# EAGLE design BlueESC (EAGLE 7.1.0)
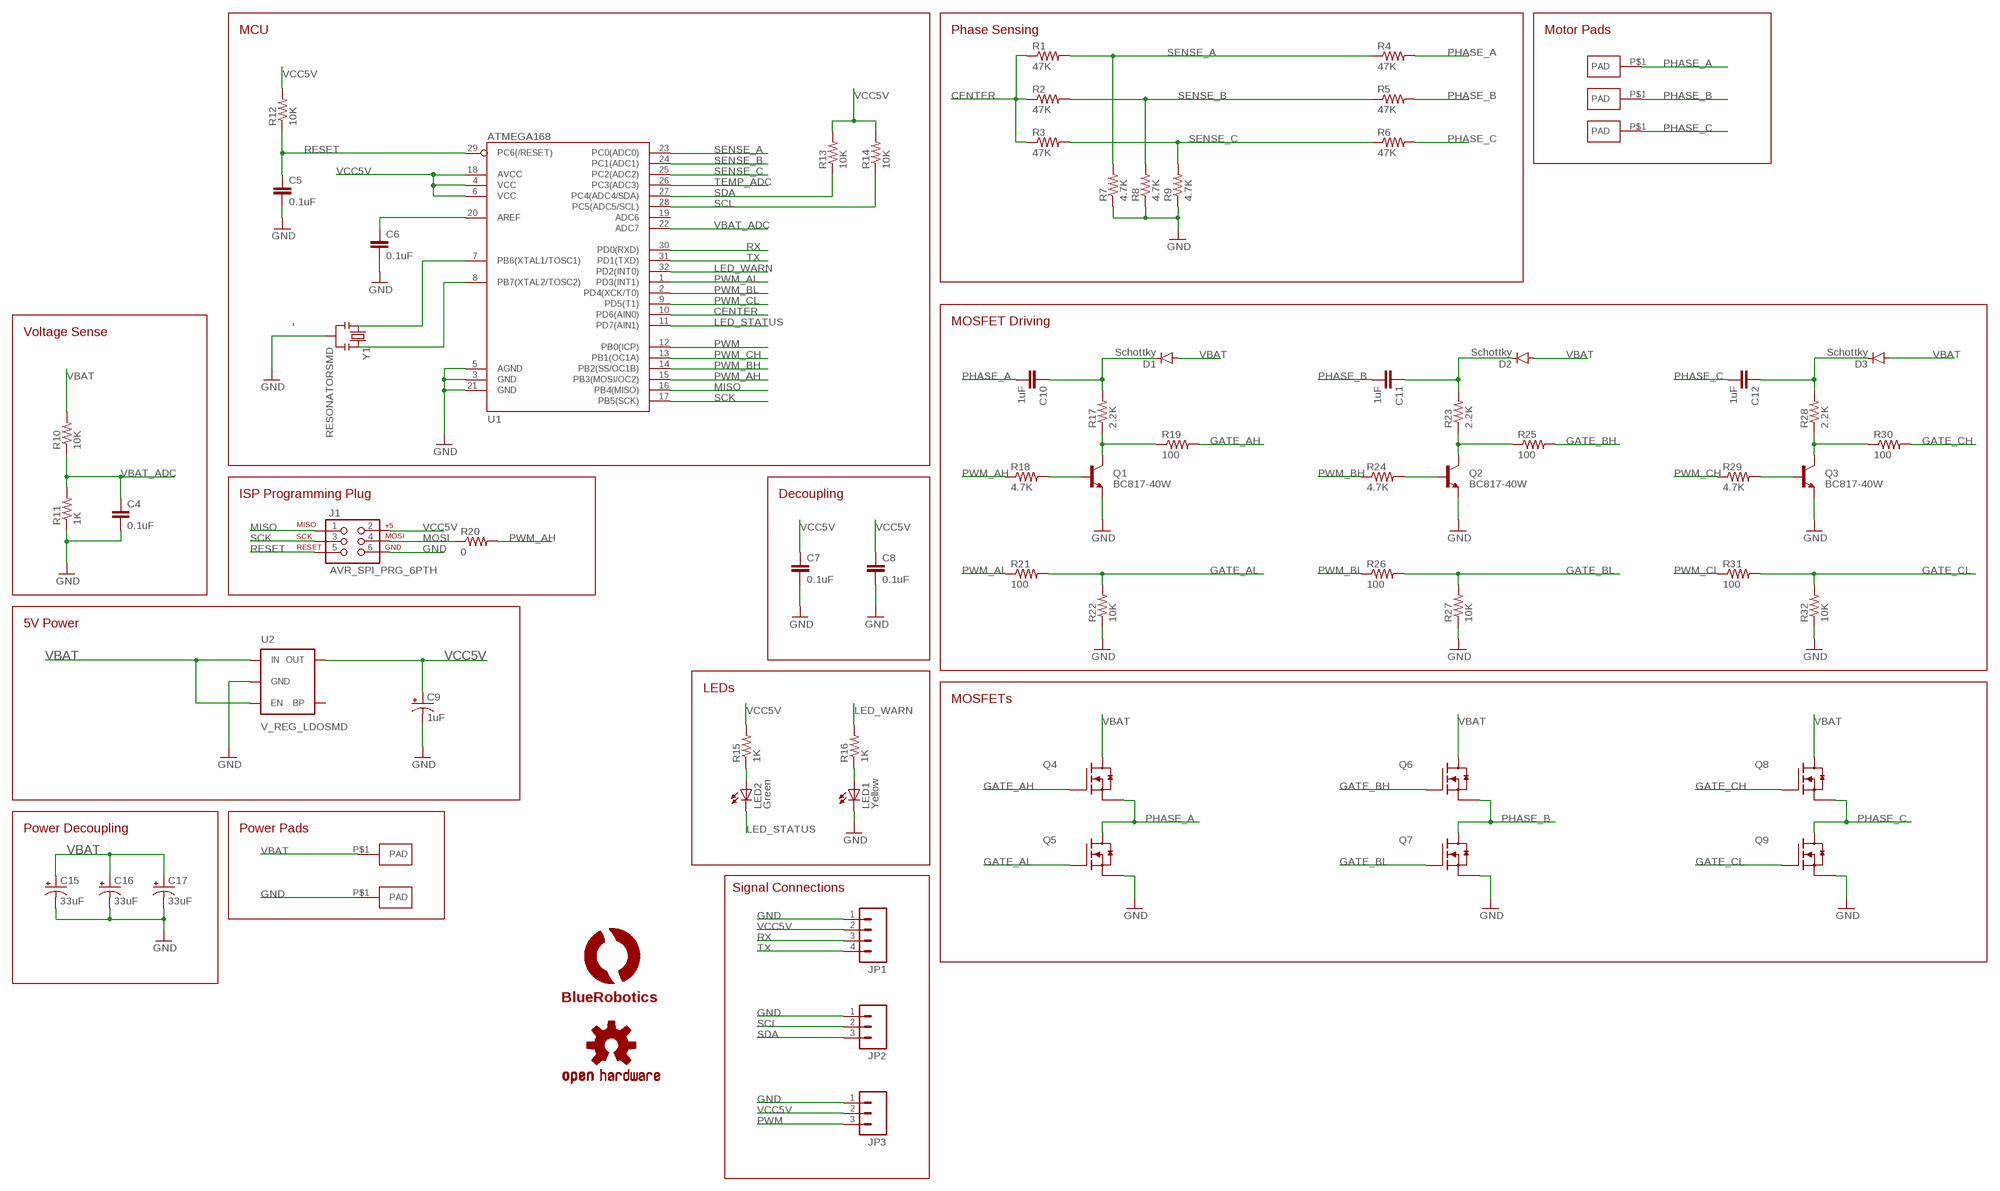
[diagram p0: schematic, sheet 1]

## Parts
C4  0.1uF  CAP0603-CAP  [0603-CAP]
C5  0.1uF  CAP0603-CAP  [0603-CAP]
C6  0.1uF  CAP0603-CAP  [0603-CAP]
C7  0.1uF  CAP0603-CAP  [0603-CAP]
C8  0.1uF  CAP0603-CAP  [0603-CAP]
C9  1uF  CAP_POL1206  [EIA3216]
C10  1uF  CAP0805  [0805]
C11  1uF  CAP0805  [0805]
C12  1uF  CAP0805  [0805]
C15  33uF  CAP_POL6032  [EIA6032]
C16  33uF  CAP_POL6032  [EIA6032]
C17  33uF  CAP_POL6032  [EIA6032]
D1  Schottky  DIODESOD  [SOD-323]
D2  Schottky  DIODESOD  [SOD-323]
D3  Schottky  DIODESOD  [SOD-323]
J1  AVR_SPI_PRG_6PTH  [2X3]
JP1  M04PTH  [1X04]
JP2  M03PTH  [1X03]
JP3  M03PTH  [1X03]
LED1  Yellow  LED0603  [LED-0603]
LED2  Green  LED0603  [LED-0603]
LOGO1  OSHW-LOGOM  [OSHW-LOGO-M]
Q1  BC817-40W  TRANSISTOR_NPNSOT23  [SOT23]
Q2  BC817-40W  TRANSISTOR_NPNSOT23  [SOT23]
Q3  BC817-40W  TRANSISTOR_NPNSOT23  [SOT23]
Q4  SI7370  [POWERPAK-SO-08]
Q5  SI7370  [POWERPAK-SO-08]
Q6  SiR158DP  SI7370  [POWERPAK-SO-08]
Q7  SI7370  [POWERPAK-SO-08]
Q8  SI7370  [POWERPAK-SO-08]
Q9  SI7370  [POWERPAK-SO-08]
R1  47K  33KOHM1/10W1%(0603)  [0603-RES]
R2  47K  33KOHM1/10W1%(0603)  [0603-RES]
R3  47K  33KOHM1/10W1%(0603)  [0603-RES]
R4  47K  33KOHM1/10W1%(0603)  [0603-RES]
R5  47K  33KOHM1/10W1%(0603)  [0603-RES]
R6  47K  33KOHM1/10W1%(0603)  [0603-RES]
R7  4.7K  RESISTOR0603  [0603-RES]
R8  4.7K  RESISTOR0603  [0603-RES]
R9  4.7K  RESISTOR0603  [0603-RES]
R10  10K  33KOHM1/10W1%(0603)  [0603-RES]
R11  1K  33KOHM1/10W1%(0603)  [0603-RES]
R12  10K  33KOHM1/10W1%(0603)  [0603-RES]
R13  10K  33KOHM1/10W1%(0603)  [0603-RES]
R14  10K  33KOHM1/10W1%(0603)  [0603-RES]
R15  1K  RESISTOR0603-RES  [0603-RES]
R16  1K  RESISTOR0603-RES  [0603-RES]
R17  2.2K  33KOHM1/10W1%(0603)  [0603-RES]
R18  4.7K  33KOHM1/10W1%(0603)  [0603-RES]
R19  100  33KOHM1/10W1%(0603)  [0603-RES]
R20  0  33KOHM1/10W1%(0603)  [0603-RES]
R21  100  33KOHM1/10W1%(0603)  [0603-RES]
R22  10K  33KOHM1/10W1%(0603)  [0603-RES]
R23  2.2K  33KOHM1/10W1%(0603)  [0603-RES]
R24  4.7K  33KOHM1/10W1%(0603)  [0603-RES]
R25  100  33KOHM1/10W1%(0603)  [0603-RES]
R26  100  33KOHM1/10W1%(0603)  [0603-RES]
R27  10K  33KOHM1/10W1%(0603)  [0603-RES]
R28  2.2K  33KOHM1/10W1%(0603)  [0603-RES]
R29  4.7K  33KOHM1/10W1%(0603)  [0603-RES]
R30  100  33KOHM1/10W1%(0603)  [0603-RES]
R31  100  33KOHM1/10W1%(0603)  [0603-RES]
R32  10K  33KOHM1/10W1%(0603)  [0603-RES]
U1  ATMEGA168  [TQFP32-08]
U2  V_REG_LDOSMD  [SOT23-5]
U$1  PADLARGE-ONE-SIDE  [PAD-0.2X0.3-ONE-SIDE]
U$2  PADLARGE-ONE-SIDE  [PAD-0.2X0.3-ONE-SIDE]
U$3  PADLARGE-ONE-SIDE  [PAD-0.2X0.3-ONE-SIDE]
U$4  LOGOBR-LOGO-M  [BR-LOGO-MEDIUM]
U$13  PADLARGE-ONE-SIDE  [PAD-0.2X0.3-ONE-SIDE]
U$14  PADLARGE-ONE-SIDE  [PAD-0.2X0.3-ONE-SIDE]
Y1  RESONATORSMD  [RESONATOR-SMD]

## Nets
CENTER: R1.1 R2.1 R3.1 U1.10(PD6(AIN0))
GATE_AH: Q4.4(G) R19.2
GATE_AL: Q5.4(G) R21.2 R22.2
GATE_BH: Q6.4(G) R25.2
GATE_BL: Q7.4(G) R26.2 R27.2
GATE_CH: Q8.4(G) R30.2
GATE_CL: Q9.4(G) R31.2 R32.2
GND: C4.2 C5.2 C6.2 C7.2 C8.2 C9.C(-) C15.P$2(-) C16.P$2(-) C17.P$2(-) J1.6 JP1.1 JP2.1 JP3.1 LED1.C Q1.2(E) Q2.2(E) Q3.2(E) Q5.3(S3) Q7.3(S3) Q9.3(S3) R7.1 R8.1 R9.1 R11.1 R22.1 R27.1 R32.1 U1.3(GND) U1.5(AGND) U1.21(GND) U2.2(GND) U$3.P$1(PAD) Y1.2
LED_STATUS: LED2.C U1.11(PD7(AIN1))
LED_WARN: R16.2 U1.32(PD2(INT0))
MISO: J1.1 U1.16(PB4(MISO))
MOSI: J1.4 R20.1
N$1: C10.1 D1.C R17.2
N$2: Q1.1(B) R18.2
N$3: LED1.A R16.1
N$4: Q1.3(C) R17.1 R19.1
N$5: Q2.1(B) R24.2
N$6: Q2.3(C) R23.1 R25.1
N$7: Q3.1(B) R29.2
N$8: C6.1 U1.20(AREF)
N$9: Q3.3(C) R28.1 R30.1
N$10: U1.7(PB6(XTAL1/TOSC1)) Y1.1
N$11: U1.8(PB7(XTAL2/TOSC2)) Y1.3
N$13: C11.1 D2.C R23.2
N$15: C12.1 D3.C R28.2
N$16: LED2.A R15.1
PHASE_A: C10.2 Q4.3(S3) Q5.5-8(D) R4.2 U$13.P$1(PAD)
PHASE_B: C11.2 Q6.3(S3) Q7.5-8(D) R5.2 U$14.P$1(PAD)
PHASE_C: C12.2 Q8.3(S3) Q9.5-8(D) R6.2 U$1.P$1(PAD)
PWM: JP3.3 U1.12(PB0(ICP))
PWM_AH: R18.1 R20.2 U1.15(PB3(MOSI/OC2))
PWM_AL: R21.1 U1.1(PD3(INT1))
PWM_BH: R24.1 U1.14(PB2(SS/OC1B))
PWM_BL: R26.1 U1.2(PD4(XCK/T0))
PWM_CH: R29.1 U1.13(PB1(OC1A))
PWM_CL: R31.1 U1.9(PD5(T1))
RESET: C5.1 J1.5 R12.1 U1.29(PC6(/RESET))
RX: JP1.3 U1.30(PD0(RXD))
SCK: J1.3 U1.17(PB5(SCK))
SCL: JP2.2 R14.1 U1.28(PC5(ADC5/SCL))
SDA: JP2.3 R13.1 U1.27(PC4(ADC4/SDA))
SENSE_A: R1.2 R4.1 R7.2 U1.23(PC0(ADC0))
SENSE_B: R2.2 R5.1 R8.2 U1.24(PC1(ADC1))
SENSE_C: R3.2 R6.1 R9.2 U1.25(PC2(ADC2))
TEMP_ADC: U1.26(PC3(ADC3))
TX: JP1.4 U1.31(PD1(TXD))
VBAT: C15.P$1(+) C16.P$1(+) C17.P$1(+) D1.A D2.A D3.A Q4.5-8(D) Q6.5-8(D) Q8.5-8(D) R10.2 U2.1(IN) U2.3(EN) U$2.P$1(PAD)
VBAT_ADC: C4.1 R10.1 R11.2 U1.22(ADC7)
VCC5V: C7.1 C8.1 C9.A(+) J1.2 JP1.2 JP3.2 R12.2 R13.2 R14.2 R15.2 U1.4(VCC) U1.6(VCC) U1.18(AVCC) U2.5(OUT)
Unconnected: Q4.1(S1) Q4.2(S2) Q5.1(S1) Q5.2(S2) Q6.1(S1) Q6.2(S2) Q7.1(S1) Q7.2(S2) Q8.1(S1) Q8.2(S2) Q9.1(S1) Q9.2(S2) U1.19(ADC6) U2.4(BP)

## Notes on the sheet
- MCU | Phase Sensing | Motor Pads
- MOSFET Driving
- Voltage Sense
- ISP Programming Plug | Decoupling
- 5V Power
- LEDs
- MOSFETs
- Power Decoupling | Power Pads
- Signal Connections

## Library data of the parts
C4-C8 C10-C12 = SparkFun-Capacitors:CAP: Capacitor Standard 0603 ceramic capacitor, and 0.1" leaded capacitor.
C9 C15-C17 = SparkFun-Capacitors:CAP_POL: Capacitor Polarized These are standard SMD and PTH capacitors. Normally 10uF, 47uF, and 100uF in electrolytic and tantalum varieties. Always verify the external diameter of the through hole cap, it varies with capacity, voltage, and manufacturer. The EIA devices should be standard.
D1-D3 = SparkFun-DiscreteSemi:DIODE: Diode These are standard reverse protection diodes and small signal diodes. SMA package can handle up to about 1A. SOD-323 can handle about 200mA. What the SOD-323 package when ordering, there are some mfgs out there that are 5-pin packages.; PROD_ID: DIO-09646
J1 = SparkFun:AVR_SPI_PRG_6: AVR ISP 6 Pin This is the reduced ISP connector for AVR programming. Common on Arduino. This footprint will take up less PCB space and can be used with a 10-pin to 6-pin adapter such as SKU: BOB-08508
JP1 = SparkFun-Connectors:M04: Header 4 Standard 4-pin 0.1" header. Use with straight break away headers (SKU : PRT-00116), right angle break away headers (PRT-00553), swiss pins (PRT-00743), machine pins (PRT-00117), and female headers (PRT-00115). Molex polarized connector foot print use with SKU : PRT-08231 with associated crimp pins and housings. 1MM SMD Version SKU: PRT-10208
JP2 JP3 = SparkFun-Connectors:M03: Header 3 Standard 3-pin 0.1" header. Use with straight break away headers (SKU : PRT-00116), right angle break away headers (PRT-00553), swiss pins (PRT-00743), machine pins (PRT-00117), and female headers (PRT-00115). Molex polarized connector foot print use with SKU : PRT-08232 with associated crimp pins and housings.
LED1 LED2 = SparkFun:LED: LEDs Standard schematic elements and footprints for 5mm, 3mm, 1206, and 0603 sized LEDs. 5mm - Spark Fun Electronics SKU : COM-00529 (and others)
LOGO1 = SparkFun-Aesthetics:OSHW-LOGO: Open Source Hardware Logo This logo indicates the piece of hardware it is found on incorporates a OSHW license and/or adheres to the definition of open source hardware found here: http://freedomdefined.org/OSHW
Q1-Q3 = SparkFun-DiscreteSemi:TRANSISTOR_NPN: Generic NPN BJT MMBT2222A - TRANS-08049 (SOT-23, 1A 40V) MPSA42 - TRANS-09116 (SOT-23, 500mA 300V) MMBT5088LT1G - TRANS-11160 (SOT-23, 50 mA 30V) BC547 - COM-08928 <http://www.sparkfun.com/products/8928> (TO-92 45V 100mA) (1.Collector 2.Base 3.Emitter) 2N3904 - COM-00521 <http://www.sparkfun.com/products/521> (TO-92 40V 200mA) (1.Emitter 2.Base 3.Collector) P2N2222A - COM-12852 <http://www.sparkfun.com/products/12852> (TO-92 40V 600mA) (1.Collector 2.Base 3.Emitter)
Q4-Q9 = transistor-fet-bobstarr:SI7370: N-Channel MOSFET - 60v
R1-R6 R10-R14 R17-R32 = SparkFun-Resistors:33KOHM1/10W1%(0603): RES-08416
R7-R9 = SparkFun-Resistors:RESISTOR: Resistor Basic schematic elements and footprints for 0603, 1206, and PTH resistors.
R15 R16 = SparkFun:RESISTOR: Resistor Basic schematic elements and footprints for 0603, 1206, and PTH resistors.
U1 = SparkFun-DigitalIC:ATMEGA168: Atmel 32-pin 8-bit micro, 16k flash.
U2 = SparkFun-PowerIC:V_REG_LDO: Voltage Regulator LDO Standard 150mA LDO voltage regulator in SOT-23 layout. Micrel part MIC5205. BP (by-pass) pin is used to lower output noise with 470pF cap.
U$1-U$3 U$13 U$14 = AT-Parts-RJ:PAD
U$4 = BR-Eagle-Library:LOGO
Y1 = SparkFun:RESONATOR: Resonator Small SMD resonator. This is the itty bitty 10/20MHz resonators with built in caps. CSTCE10M0G55 and CSTCE20M0V53. Footprint has been reviewed closely but hasn't been tested yet.

## Board
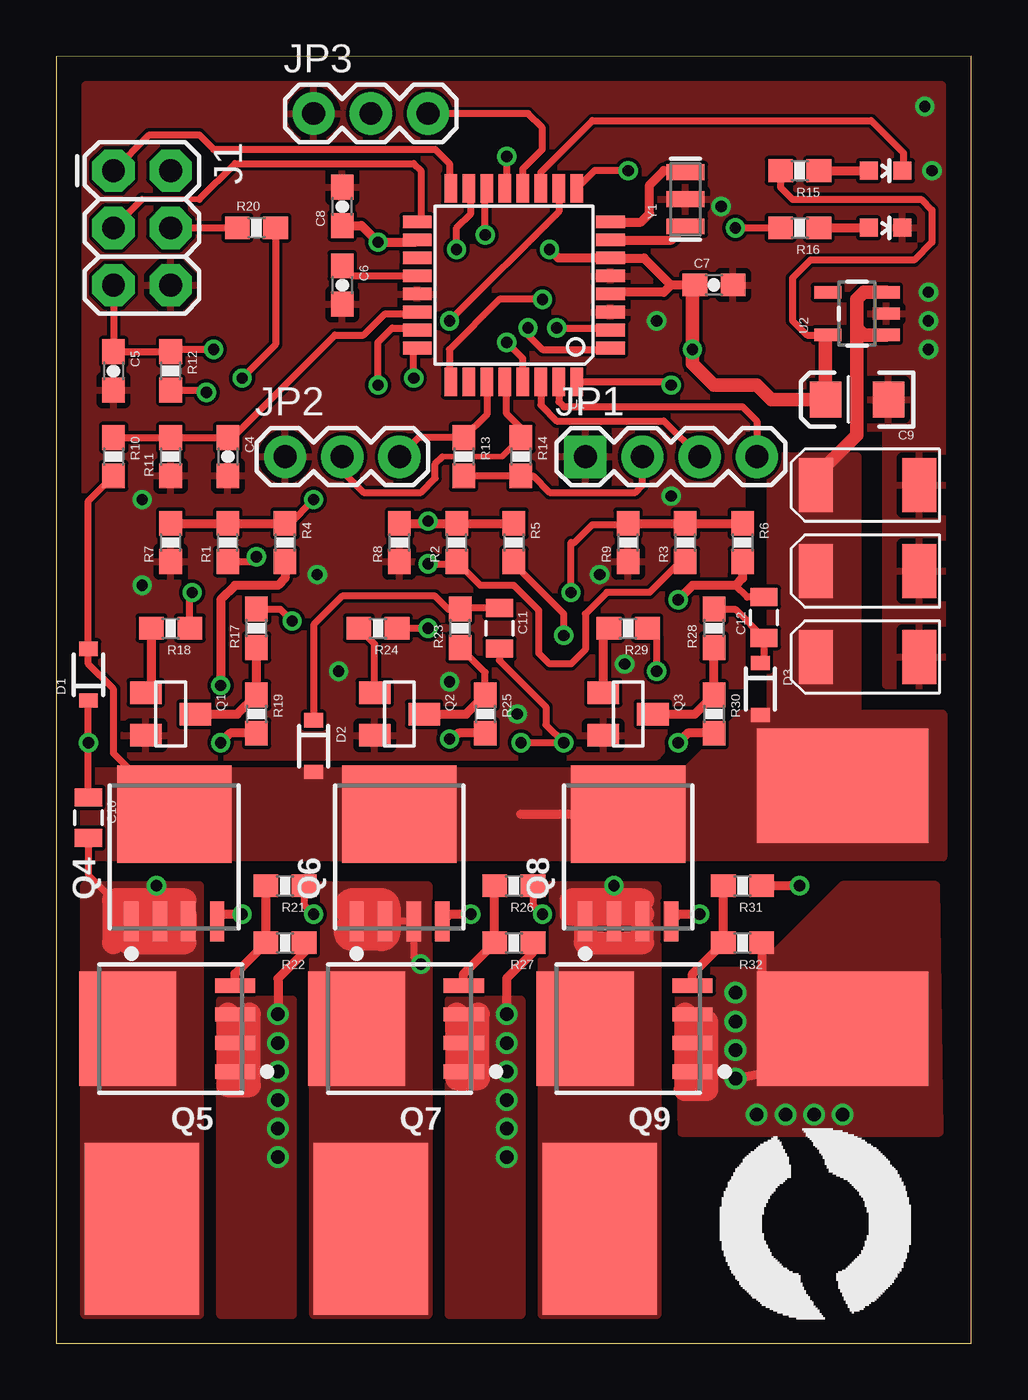
[diagram p1: board, top side]
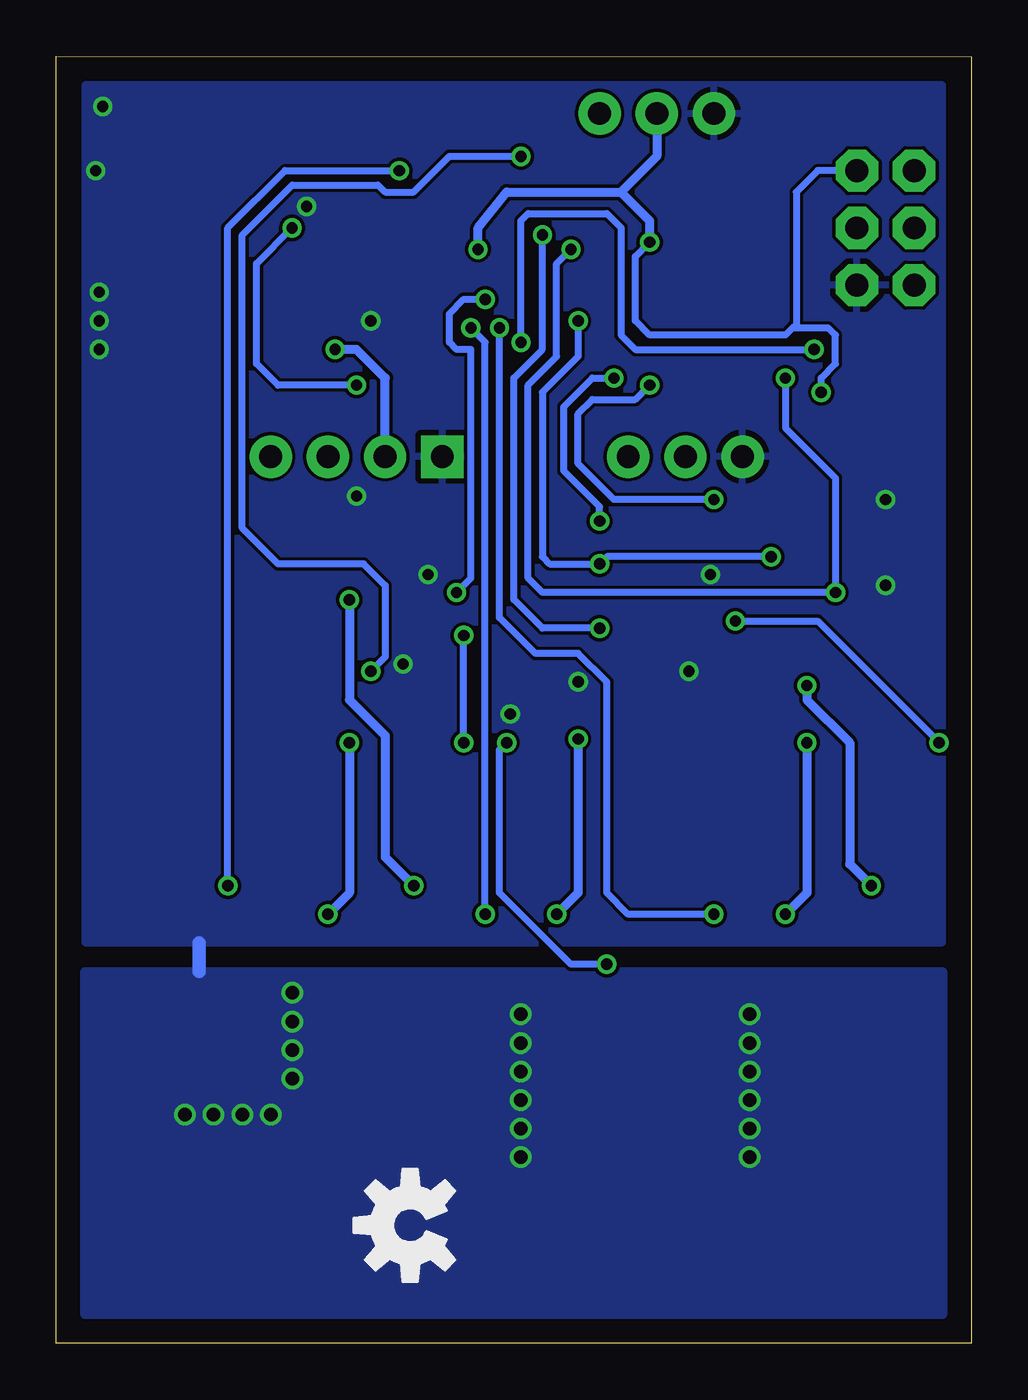
[diagram p2: board, bottom side, seen from below]

Size 40.64 x 57.15 mm. Coordinates in mm from the lower left corner, seen from the top.
Outline: 0,0 40.64,0 40.64,57.15 0,57.14 0,0
Copper layers (1*16): Top 0.0356mm / dielectric 1.5011mm / Bottom 0.0356mm
Design rules "OSH-Park": minimum track width 6mil, minimum drill 13mil, track to track 6mil, track to pad 6mil, pad to pad 6mil, via to via 6mil, smd to smd 6mil, copper to edge 15mil, drill to drill 6mil, minimum pad ring 7mil, minimum via ring 7mil, stop-mask expansion 3mil, vias tented up to drill 0mil, thermal gap 10mil

### Footprints (pad centres in the part's own frame; a part is rotated, then mirrored left to right if it is on the bottom)
0603-CAP = smd 1.1 x 1: 1 -0.85,0; 2 0.85,0
EIA3216 = smd 1.4 x 1.6: A 1.4,0; C -1.4,0
0805 = smd 0.8 x 1.2: 1 -0.9,0; 2 0.9,0
EIA6032 = smd 1.5 x 2.4: P$1 -2.3,0; P$2 2.3,0
SOD-323 = smd 0.63 x 0.83: A 1.15,0; C -1.15,0
2X3 = drill 1.016 pad 1.88 octagon: 1 0,0; 2 0,2.54; 3 2.54,0; 4 2.54,2.54; 5 5.08,0; 6 5.08,2.54
1X04 = drill 1.016 pad 1.88 square: 1 0,0 | drill 1.016 pad 1.88: 2 2.54,0; 3 5.08,0; 4 7.62,0
1X03 = drill 1.016 pad 1.88: 1 0,0; 2 2.54,0; 3 5.08,0
LED-0603 = smd 0.8 x 0.8: A 0,-0.75; C 0,0.75
SOT23 = smd 1 x 1.4: 1 -0.95,-1.1; 2 0.95,-1.1; 3 0,1.1
POWERPAK-SO-08 = smd 0.635 x 1.778: 1 -1.905,-2.857; 2 -0.635,-2.857; 3 0.635,-2.857; 4 1.905,-2.857 | smd 5.08 x 4.318: 5-8 0,1.905
0603-RES = smd 1.1 x 1: 1 -0.85,0; 2 0.85,0
TQFP32-08 = smd 1.27 x 0.559: 1 -4.293,2.8; 2 -4.293,2; 3 -4.293,1.2; 4 -4.293,0.4; 5 -4.293,-0.4; 6 -4.293,-1.2; 7 -4.293,-2; 8 -4.293,-2.8; 17 4.293,-2.8; 18 4.293,-2; 19 4.293,-1.2; 20 4.293,-0.4; 21 4.293,0.4; 22 4.293,1.2; 23 4.293,2; 24 4.293,2.8 | smd 0.559 x 1.27: 9 -2.8,-4.293; 10 -2,-4.293; 11 -1.2,-4.293; 12 -0.4,-4.293; 13 0.4,-4.293; 14 1.2,-4.293; 15 2,-4.293; 16 2.8,-4.293; 25 2.8,4.293; 26 2,4.293; 27 1.2,4.293; 28 0.4,4.293; 29 -0.4,4.293; 30 -1.2,4.293; 31 -2,4.293; 32 -2.8,4.293
SOT23-5 = smd 0.55 x 1.2: 1 -0.95,-1.3; 2 0,-1.3; 3 0.95,-1.3; 4 0.95,1.3; 5 -0.95,1.3
PAD-0.2X0.3-ONE-SIDE = smd 5.08 x 7.62: P$1 0,0
RESONATOR-SMD = smd 0.7 x 1.7: 1 -1.2,0; 2 0,0; 3 1.2,0

### Placement (x,y rotation side)
C4  7.62,39.37 270 top
C5  2.54,43.18 270 top
C6  12.7,46.99 270 top
C7  29.21,46.99 0 top
C8  12.7,50.48 90 top
C9  35.56,41.91 180 top
C10  1.43,23.34 270 top
C11  19.68,31.75 270 top
C12  31.43,32.23 90 top
C15  36.04,30.48 0 top
C16  36.04,34.29 0 top
C17  36.04,38.1 0 top
D1  1.43,29.69 90 top
D2  11.43,26.51 270 top
D3  31.27,29.05 270 top
J1  2.54,52.07 270 top
JP1  23.5,39.37 0 top
JP2  10.16,39.37 0 top
JP3  11.43,54.61 0 top
LED1  36.83,49.53 270 top
LED2  36.83,52.07 270 top
LOGO1  24.92,5.24 90 bottom
Q1  5.08,27.94 270 top
Q2  15.24,27.94 270 top
Q3  25.4,27.94 270 top
Q4  5.24,21.59 0 top
Q5  5.08,13.97 90 top
Q6  15.24,21.59 0 top
Q7  15.24,13.97 90 top
Q8  25.4,21.59 0 top
Q9  25.4,13.97 90 top
R1  7.62,35.56 90 top
R2  17.78,35.56 90 top
R3  27.94,35.56 90 top
R4  10.16,35.56 270 top
R5  20.32,35.56 270 top
R6  30.48,35.56 270 top
R7  5.08,35.56 90 top
R8  15.24,35.56 90 top
R9  25.4,35.56 90 top
R10  2.54,39.37 270 top
R11  5.08,39.37 90 top
R12  5.08,43.18 270 top
R13  18.1,39.37 270 top
R14  20.64,39.37 270 top
R15  33.02,52.07 180 top
R16  33.02,49.53 180 top
R17  8.89,31.75 90 top
R18  5.08,31.75 180 top
R19  8.89,27.94 270 top
R20  8.89,49.53 0 top
R21  10.16,20.32 180 top
R22  10.16,17.78 180 top
R23  17.94,31.75 90 top
R24  14.29,31.75 180 top
R25  19.05,27.94 270 top
R26  20.32,20.32 180 top
R27  20.32,17.78 180 top
R28  29.21,31.75 90 top
R29  25.4,31.75 180 top
R30  29.21,27.94 270 top
R31  30.48,20.32 180 top
R32  30.48,17.78 180 top
U1  20.32,46.99 180 top
U2  35.56,45.72 90 top
U$1  24.13,5.08 0 top
U$2  34.92,24.77 90 top
U$3  34.92,13.97 90 top
U$4  29.53,1.11 0 top
U$13  3.81,5.08 0 top
U$14  13.97,5.08 0 top
Y1  27.94,50.8 90 top

### Tracks (layer width: path | path; a pad name or v marks a point on that pad's centre or on a via)
CENTER  (via drill 0.5)
  Top 0.305: R1.1 8.68,34.71 v8.89,34.92 | v16.51,34.61 17.68,34.61 R2.1 18.84,33.66 20.32,33.66 21.43,32.54 21.43,30.64 21.91,30.16 22.86,30.16 23.5,30.8 23.5,32.38 24.45,33.34 26.35,33.34 27.73,34.71 R3.1 | U1.10 22.32,50.26 v17.46,45.4
  Bottom 0.305: v8.89,34.92 16.19,34.92 v16.51,34.61 18.73,34.61 19.05,34.92 19.05,42.23 17.46,43.81 v17.46,45.4
GATE_AH  (via drill 0.5)
  Top 0.406: R19.2 7.72,27.09 v7.3,26.67 | v8.26,19.05 7.3,19.05 Q4.4
  Bottom 0.406: v7.3,26.67 7.3,20 v8.26,19.05
GATE_AL
  Top 0.406: Q5.4 7.94,16.41 R22.2 R21.2
GATE_BH  (via drill 0.5)
  Top 0.406: R25.2 17.88,27.09 v17.46,26.83 | v18.41,19.05 17.46,19.05 Q6.4
  Bottom 0.406: v17.46,26.83 17.46,20 v18.41,19.05
GATE_BL
  Top 0.406: Q7.4 18.1,16.41 R27.2 R26.2
GATE_CH  (via drill 0.5)
  Top 0.406: R30.2 28.04,27.09 v27.62,26.67 | v28.57,19.05 27.62,19.05 Q8.4
  Bottom 0.406: v27.62,26.67 27.62,20 v28.57,19.05
GATE_CL
  Top 0.406: Q9.4 28.26,16.41 R32.2 R31.2
GND  (via drill 0.5, 0.6)
  Top 0.406: R22.1 11.01,17.36 9.84,16.19 v9.84,14.61 | R27.1 21.17,17.36 20,16.19 v20,14.61 | R32.1 31.33,11.96 v30.16,11.75
  Top 1.016: 27.94,14.61 27.94,11.27 28.89,11.27 28.89,14.29 | 7.62,14.61 7.62,11.43 8.57,11.43 8.57,14.61 | 17.78,14.61 17.78,11.75 18.73,11.75 18.73,14.61
  Bottom 0.61: 34.29,17.78 34.29,16.51
  other vias: 20,13.34 20,12.06 20,10.79 20,9.53 20,8.26 9.84,8.26 9.84,9.53 9.84,10.79 9.84,12.06 9.84,13.34 31.11,10.16 32.38,10.16 33.66,10.16 34.92,10.16 30.16,13.02 30.16,14.29 30.16,15.56 3.81,37.47 3.81,33.66 11.59,34.13 12.54,29.84 24.13,34.13 26.67,45.4 29.53,50.48 20.48,27.94 27.3,37.62 25.24,30.16 17.46,29.37 38.73,46.67 38.73,45.4 38.73,44.13 38.89,52.07 38.58,54.93
  pour Top (no thermals): 39.05,20.32 34.92,20.32 31.11,16.51 27.62,16.51 27.78,9.37 39.21,9.37
  pour Top (no thermals): 7.3,15.24 10.48,15.24 10.48,1.27 7.3,1.27
  pour Top (no thermals): 17.46,15.24 20.64,15.24 20.64,1.27 17.46,1.27
  pour Bottom (no thermals): 39.37,16.51 1.27,16.51 1.27,1.27 39.37,1.27
  pour Top: 1.27,26.04 26.67,26.04 29.21,29.21 30.48,29.21 30.48,40.64 36.83,40.64 36.83,29.21 39.37,29.21 39.37,55.88 1.27,55.88
  pour Bottom: 1.27,17.78 1.27,55.88 39.37,55.88 39.37,17.78
LED_STATUS
  Top 0.305: U1.11 21.52,52 23.81,54.29 36.2,54.29 37.62,52.86 37.62,52.11 LED2.C
LED_WARN  (via drill 0.5)
  Top 0.305: U1.32 27.15,42.7 v27.3,42.55 | v30.16,49.53 R16.2
  Bottom 0.305: v27.3,42.55 30.8,42.55 31.75,43.5 31.75,47.94 v30.16,49.53
MISO
  Top 0.305: J1.1 4.13,53.66 6.35,53.66 6.99,53.02 16.83,53.02 17.46,52.39 17.46,51.34 U1.16
MOSI
  Top 0.305: J1.4 R20.1
N$1  (via drill 0.5)
  Top 0.305: C10.1 v1.43,26.67 1.43,26.83 D1.C | R17.2 9.95,32.6 v10.48,32.07
  Bottom 0.305: v10.48,32.07 6.83,32.07 v1.43,26.67
N$2
  Top 0.406: Q1.1 4.23,28.89 R18.2
N$3
  Top 0.406: R16.1 LED1.A
N$4
  Top 0.406: Q1.3 8.04,27.94 R19.1 R17.1
N$5
  Top 0.305: Q2.1 14.14,31.05 R24.2
  Top 0.406: Q2.1 14.39,28.89
N$6
  Top 0.305: R25.1 19.05,29.79 R23.1
  Top 0.406: Q2.3 18.2,27.94 R25.1
N$7
  Top 0.406: Q3.1 24.3,31.5 R29.2
N$8
  Top 0.305: U1.20 13.15,47.39 C6.1
N$9
  Top 0.406: Q3.3 28.36,27.94 R30.1 R28.1
N$10
  Top 0.406: U1.7 27.33,48.99 Y1.1
N$11
  Top 0.406: U1.8 25.98,49.79 26.35,50.16 26.35,51.44 26.99,52.07 27.87,52.07 Y1.3
N$13
  Top 0.305: C11.1 17.99,32.65 R23.2 17.41,32.6 16.83,33.18 12.7,33.18 11.43,31.91 D2.C
N$15
  Top 0.305: R28.2 30.16,32.6 C12.1 31.43,30.36 D3.C
N$16
  Top 0.406: R15.1 LED2.A
PHASE_A  (via drill 0.5)
  Top 0.305: C10.2 1.43,20.8 3.17,19.05
  Top 0.406: R4.2 10.16,33.97 9.84,33.66 7.94,33.66 7.3,33.02 v7.3,29.21 | v4.45,20.32 4.45,20 4.76,19.68
  Top 1.016: 5.71,19.68 4.76,19.68 2.54,19.68 | 2.54,19.68 3.17,19.05 5.71,19.05 5.71,18.41 3.17,18.41 3.17,17.78 5.71,17.78 | 2.54,19.68 2.54,17.78
  Bottom 0.406: v7.3,29.21 7.3,28.57 5.4,26.67 5.4,21.27 v4.45,20.32
  pour Top (no thermals): 1.27,1.27 1.27,20.32 6.35,20.32 6.35,1.27
PHASE_B  (via drill 0.5)
  Top 0.305: v16.19,16.83 15.88,17.14 Q6.3 14.76,18.73 14.45,19.05 | v20.64,26.67 v22.54,26.67 21.75,27.46 21.75,28.26 19.68,30.32 C11.2 | v22.54,31.43 22.54,32.38 20.64,34.29 20.64,34.39 R5.2
  Top 1.676: 13.18,19.37 14.45,19.37 14.45,19.05 14.45,18.26 13.18,18.26
  Bottom 0.305: v16.19,16.83 17.78,16.83 20.95,20 20.95,26.35 v20.64,26.67 | v22.54,26.67 v22.54,31.43
  pour Top (no thermals): 11.43,1.27 11.43,20.32 16.51,20.32 16.51,1.27
PHASE_C  (via drill 0.5)
  Top 0.305: C12.2 30.69,33.13 30.16,33.66
  Top 0.406: R6.2 30.48,33.97 30.16,33.66 28.26,33.66 v27.62,33.02 | v24.77,20.32 24.77,19.68
  Top 1.016: 26.04,19.05 23.5,19.05 23.5,17.78 26.04,17.78 26.04,18.41 | 26.04,19.68 24.77,19.68 22.86,19.68 22.86,19.05
  Bottom 0.406: v27.62,33.02 27.62,28.57 26.04,26.99 26.04,21.59 v24.77,20.32
  pour Top (no thermals): 21.59,1.27 21.59,20.32 26.67,20.32 26.67,1.27
PWM
  Top 0.305: U1.12 20.72,52.15 21.59,53.02 21.59,53.98 20.95,54.61 JP3.3
PWM_AH  (via drill 0.5)
  Top 0.305: R18.1 5.93,33.23 v6.03,33.34 | v17.78,48.58 17.78,49.53 18.41,50.16 18.41,51.19 U1.15 | R20.2 9.74,44.35 v8.26,42.86
  Bottom 0.305: v17.78,48.58 18.41,47.94 18.41,43.81 19.68,42.55 19.68,33.97 19.05,33.34 v6.03,33.34 6.03,38.42 8.26,40.64 v8.26,42.86
PWM_AL  (via drill 0.5)
  Top 0.305: R21.1 11.01,19.47 v11.43,19.05 | v20.95,45.09 20.95,44.77 21.59,44.13 24.55,44.13 U1.1
  Bottom 0.305: v11.43,19.05 15.24,19.05 16.19,20 16.19,29.37 17.46,30.64 19.37,30.64 20.95,32.23 v20.95,45.09
PWM_BH  (via drill 0.5)
  Top 0.305: R24.1 v16.51,31.75 | v19.05,49.21 19.05,51.21 U1.14
  Bottom 0.305: v16.51,31.75 19.05,31.75 20.32,33.02 20.32,42.86 19.05,44.13 v19.05,49.21
PWM_BL  (via drill 0.5)
  Top 0.305: R26.1 21.17,19.47 v21.59,19.05 | v22.23,45.09 24.52,45.09 U1.2
  Bottom 0.305: v21.59,19.05 21.59,44.45 v22.23,45.09
PWM_CH  (via drill 0.5)
  Top 0.305: v20,52.7 20,51.37 U1.13 | v26.67,29.84 26.67,31.33 R29.1
  Bottom 0.305: v20,52.7 23.18,52.7 24.77,51.12 26.04,51.12 26.35,51.44 30.16,51.44 32.38,49.21 32.38,36.2 30.8,34.61 26.99,34.61 26.04,33.66 26.04,30.48 v26.67,29.84
PWM_CL  (via drill 0.5)
  Top 0.305: v25.4,52.07 23.91,52.07 U1.9
  Top 0.406: R31.1 v33.02,20.32
  Bottom 0.305: v33.02,20.32 33.02,49.53 30.48,52.07 v25.4,52.07
RESET  (via drill 0.5)
  Top 0.305: J1.5 C5.1 R12.1 5.18,44.13 v6.99,44.13 | U1.29 20.72,43.73 v20,44.45
  Bottom 0.305: v20,44.45 20,49.85 19.68,50.16 16.19,50.16 15.56,49.53 15.56,44.77 14.92,44.13 v6.99,44.13
RX
  Top 0.305: U1.30 21.52,41.66 22.23,40.96 26.99,40.96 JP1.3
SCK
  Top 0.254: 3.81,50.8 6.35,50.8
  Top 0.305: J1.3 3.81,50.8 | 6.35,50.8 7.94,52.39 15.88,52.39 16.19,52.07 16.19,49.95 U1.17
SCL
  Top 0.254: 17.14,39.37 19.79,39.37 R14.1
  Top 0.305: R14.1 20.64,40.64 20,41.27 20,42.62 U1.28 | JP2.2 12.7,38.73 13.65,37.78 16.19,37.78 16.83,38.42 16.83,39.05 17.14,39.37
SDA
  Top 0.305: U1.27 19.12,41.24 R13.1 16.09,40.22 JP2.3
SENSE_A  (via drill 0.5)
  Top 0.305: R4.1 10.38,36.41 v11.43,37.47 | v14.29,42.55 14.29,44.45 14.92,45.09 15.93,45.09 U1.23
  Top 0.406: R7.2 R1.2 R4.1
  Bottom 0.305: v11.43,37.47 15.88,37.47 17.46,39.05 17.46,41.27 16.83,41.91 14.92,41.91 v14.29,42.55
SENSE_B  (via drill 0.5)
  Top 0.305: R8.2 16.41,36.41 v16.51,36.51 | v15.88,42.86 15.88,44.04 U1.24
  Top 0.406: R8.2 R2.2 R5.1
  Bottom 0.305: v16.51,36.51 16.51,37.15 18.1,38.73 18.1,41.59 16.83,42.86 v15.88,42.86
SENSE_C  (via drill 0.5)
  Top 0.305: v21.59,46.35 19.68,46.35 17.46,44.13 17.46,42.76 U1.25 | v22.86,33.34 22.86,35.56 23.02,35.56 23.81,36.35 25.34,36.35 R9.2
  Top 0.406: R9.2 R3.2 R6.1
  Bottom 0.305: v22.86,33.34 22.23,33.97 22.23,44.13 22.86,44.13 23.18,44.45 23.18,45.72 22.54,46.35 v21.59,46.35
TX
  Top 0.305: U1.31 22.32,41.81 22.54,41.59 30.48,41.59 31.11,40.96 JP1.4
VBAT
  Top 0.305: Q4.5-8 2.54,26.19 2.54,29.05 1.43,30.16 D1.A 1.43,37.41 R10.2
  Top 0.406: 20.64,23.5 Q8.5-8
  Top 0.61: C17.P$1 33.34,38.1 35.56,40.32 35.56,45.09 | 35.56,45.09 35.56,46.35 35.88,46.67 U2.3 | U2.1 35.88,44.77 35.56,45.09
  pour Top (no thermals): 39.37,21.59 1.27,21.59 1.27,25.4 27.94,25.4 30.48,27.94 39.37,27.94
  pour Top (no thermals): 31.75,27.94 31.75,39.37 35.56,39.37 35.56,27.94
VBAT_ADC
  Top 0.305: R10.1 R11.2 C4.1 7.83,40.22 12.38,44.77 13.65,44.77 14.61,45.72 15.96,45.72 U1.22
VCC5V  (via drill 0.5)
  Top 0.305: R13.2 R14.2 21.17,38.52 21.91,37.78 25.72,37.78 26.04,38.1 JP1.2 | R12.2 6.57,42.33 v6.67,42.23 | R15.2 32.17,51.33 32.7,50.8 38.42,50.8 38.89,50.32 38.89,48.9 38.1,48.1 33.5,48.1 32.7,47.31 32.7,45.4 33.34,44.77 U2.5
  Top 0.406: C7.1 27.3,46.99 | 27.3,46.99 26.99,46.67 24.7,46.67 U1.4 | 27.3,46.99 26.11,48.19 U1.6 22.3,48.19 v21.91,48.58 | U1.18 15.93,48.9 v14.29,48.9 13.55,49.63 C8.1
  Top 0.61: C7.1 28.26,46.89 v28.26,44.13 28.26,43.5 29.21,42.55 31.11,42.55 31.75,41.91 C9.A 34.16,44.67 U2.5
  Bottom 0.305: v6.67,42.23 6.67,42.86 6.03,43.5 6.03,44.77 6.35,45.09 7.94,45.09 | 7.94,45.09 8.26,44.77 14.29,44.77 14.92,45.4 14.92,48.26 v14.29,48.9 | J1.2 6.83,52.07 7.78,51.12 7.78,45.24 7.94,45.09
  Bottom 0.406: v21.91,48.58 21.91,49.53 20.64,51.12 15.56,51.12 | 15.56,51.12 14.29,49.85 v14.29,48.9 | JP1.2 26.04,42.86 27.3,44.13 v28.26,44.13 | JP3.2 13.97,52.7 15.56,51.12

### Text on the board
tDocu: BLDC ESC - rev1 | STATUS | GND | 5V | PWM | WARN | ISP | GND | SCL | SDA | GND | 5V | RX | TX | BATT+ | BATT- | PHASE A | PHASE B | PHASE C
bDocu: Designed by R. Jehangir - 7/14